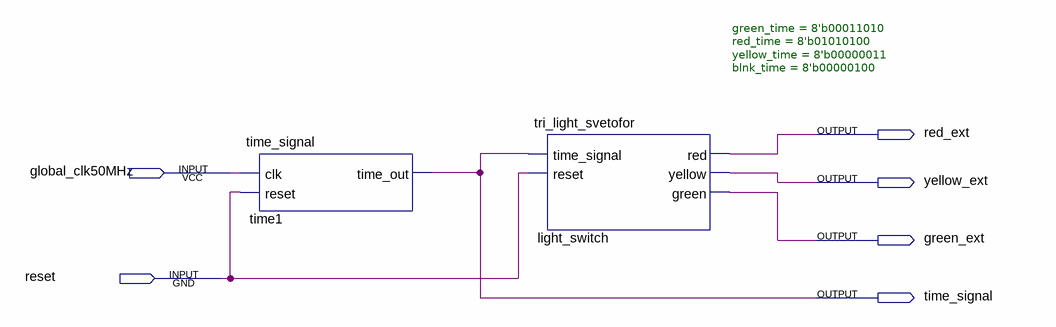
[diagram p0: schematic sheet]
// Quartus schematic Svetofors.bdf as structural Verilog: 2 symbols, 6 pins
module Svetofors (
  input  global_clk50MHz,
  input  reset,
  output red_ext,
  output yellow_ext,
  output green_ext,
  output time_signal
);

  time_signal time1 (.clk(global_clk50MHz), .reset(reset), .time_out(time_signal));
  tri_light_svetofor #(.green_time(8'b00011010), .red_time(8'b01010100), .yellow_time(8'b00000011), .blnk_time(8'b00000100)) light_switch (
    .time_signal(time_signal), .reset(reset), .red(red_ext), .yellow(yellow_ext), .green(green_ext));
endmodule
